# EAGLE design board (EAGLE 9.6.2)
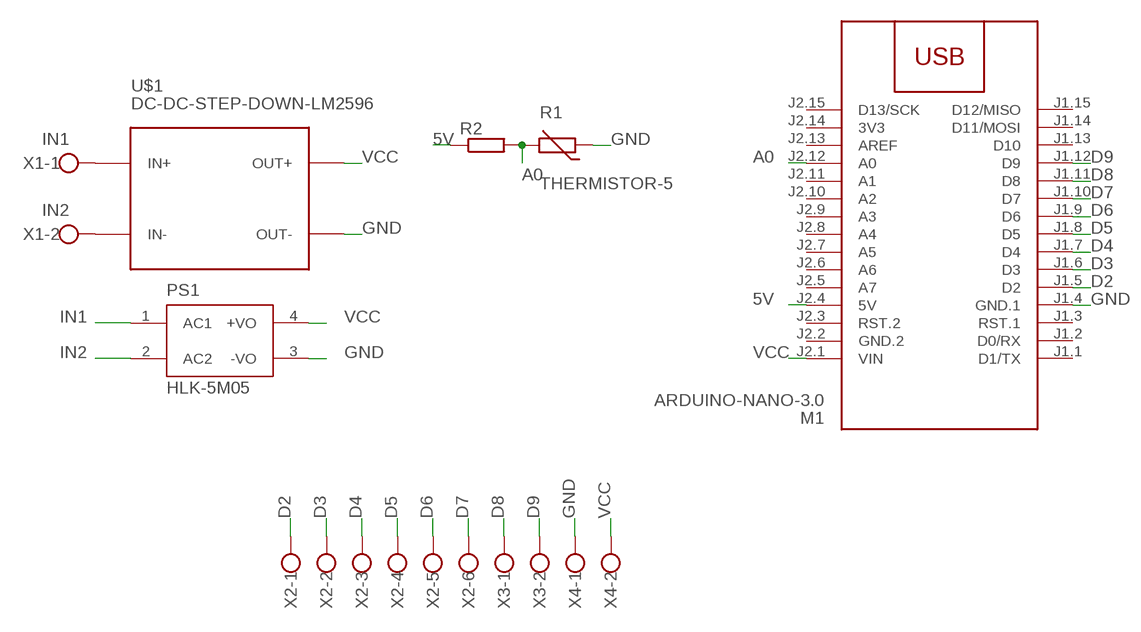
[diagram p0: schematic, sheet 1]

## Parts
M1  ARDUINO-NANO-3.0  [ARDUINO-NANO-3.0]
PS1  HLK-5M05  [CONV_HLK-5M05]
R1  THERMISTOR-5  [R-5]
R2  R-EU_0207/10  [0207/10]
U$1  DC-DC-STEP-DOWN-LM2596  [DC-DC-STEP-DOWN-LM2596]
X1  W237-102  [W237-102]
X2  W237-136  [W237-136]
X3  W237-102  [W237-102]
X4  W237-102  [W237-102]

## Nets
5V: M1.J2.4(5V) R2.1
A0: M1.J2.12(A0) R1.2 R2.2
D2: M1.J1.5(D2) X2.1
D3: M1.J1.6(D3) X2.2
D4: M1.J1.7(D4) X2.3
D5: M1.J1.8(D5) X2.4
D6: M1.J1.9(D6) X2.5
D7: M1.J1.10(D7) X2.6
D8: M1.J1.11(D8) X3.1
D9: M1.J1.12(D9) X3.2
GND: M1.J1.4(GND.1) PS1.3(-VO) R1.1 U$1.OUT- X4.1
IN1: PS1.1(AC1) U$1.IN+ X1.1
IN2: PS1.2(AC2) U$1.IN- X1.2
VCC: M1.J2.1(VIN) PS1.4(+VO) U$1.OUT+ X4.2
Unconnected: M1.J1.1(D1/TX) M1.J1.2(D0/RX) M1.J1.3(RST.1) M1.J1.13(D10) M1.J1.14(D11/MOSI) M1.J1.15(D12/MISO) M1.J2.3(RST.2) M1.J2.5(A7) M1.J2.6(A6) M1.J2.7(A5) M1.J2.8(A4) M1.J2.9(A3) M1.J2.10(A2) M1.J2.11(A1) M1.J2.13(AREF) M1.J2.15(D13/SCK)

## Power pins joined to a net without a drawn wire
3V3: M1.J2.14(3V3)
GND.2: M1.J2.2(GND.2)

## Library data of the parts
M1 = diy-modules:ARDUINO-NANO-3.0: Arduino Nano 3.0 and compatible devices More details available here: https://www.arduino.cc/en/Main/ArduinoBoardNano Click here to find device on ebay.com <http://www.ebay.com/sch/arduino+nano>
PS1 = HLK-5M05:HLK-5M05: AC DC 220V to 5V 5W 5Watt Isolated Switching Step-Down Power Supply Module Converter; AVAILABILITY: Unavailable; MF: Hi-link; MP: HLK-5M05; PACKAGE: Package Analog Devices; PRICE: None
R1 = varistor:THERMISTOR: THERMISTOR
R2 = rcl:R-EU_: RESISTOR, European symbol; SPICEPREFIX: R
U$1 = diy-modules:DC-DC-STEP-DOWN-LM2596: DC/DC Step-Down Regulator based on LM2596-ADJ chip LM2596 datasheet available here: http://www.ti.com/lit/ds/symlink/lm2596.pdf Click here to find device on ebay.com <http://www.ebay.com/sch/lm2596+power+regulator>
X1 X3 X4 = con-wago-500:W237-102: WAGO SCREW CLAMP; MPN: 237-102; OC_FARNELL: unknown; OC_NEWARK: 70K9898
X2 = con-wago-500:W237-136: WAGO SCREW CLAMP; MPN: 237-136; OC_FARNELL: unknown; OC_NEWARK: 84K9151

## Board
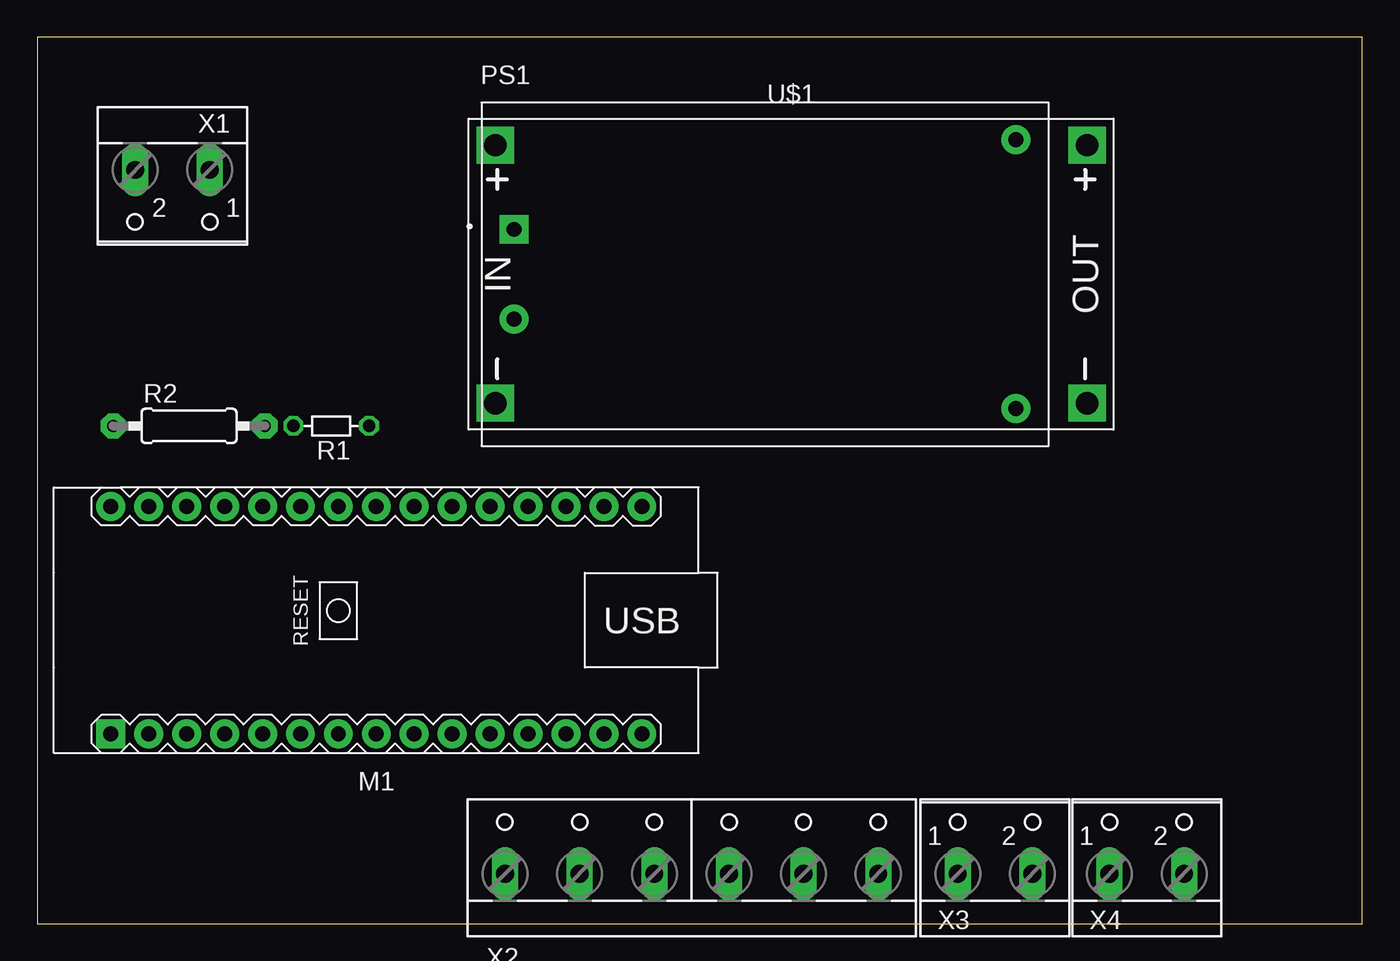
[diagram p1: board, top side]
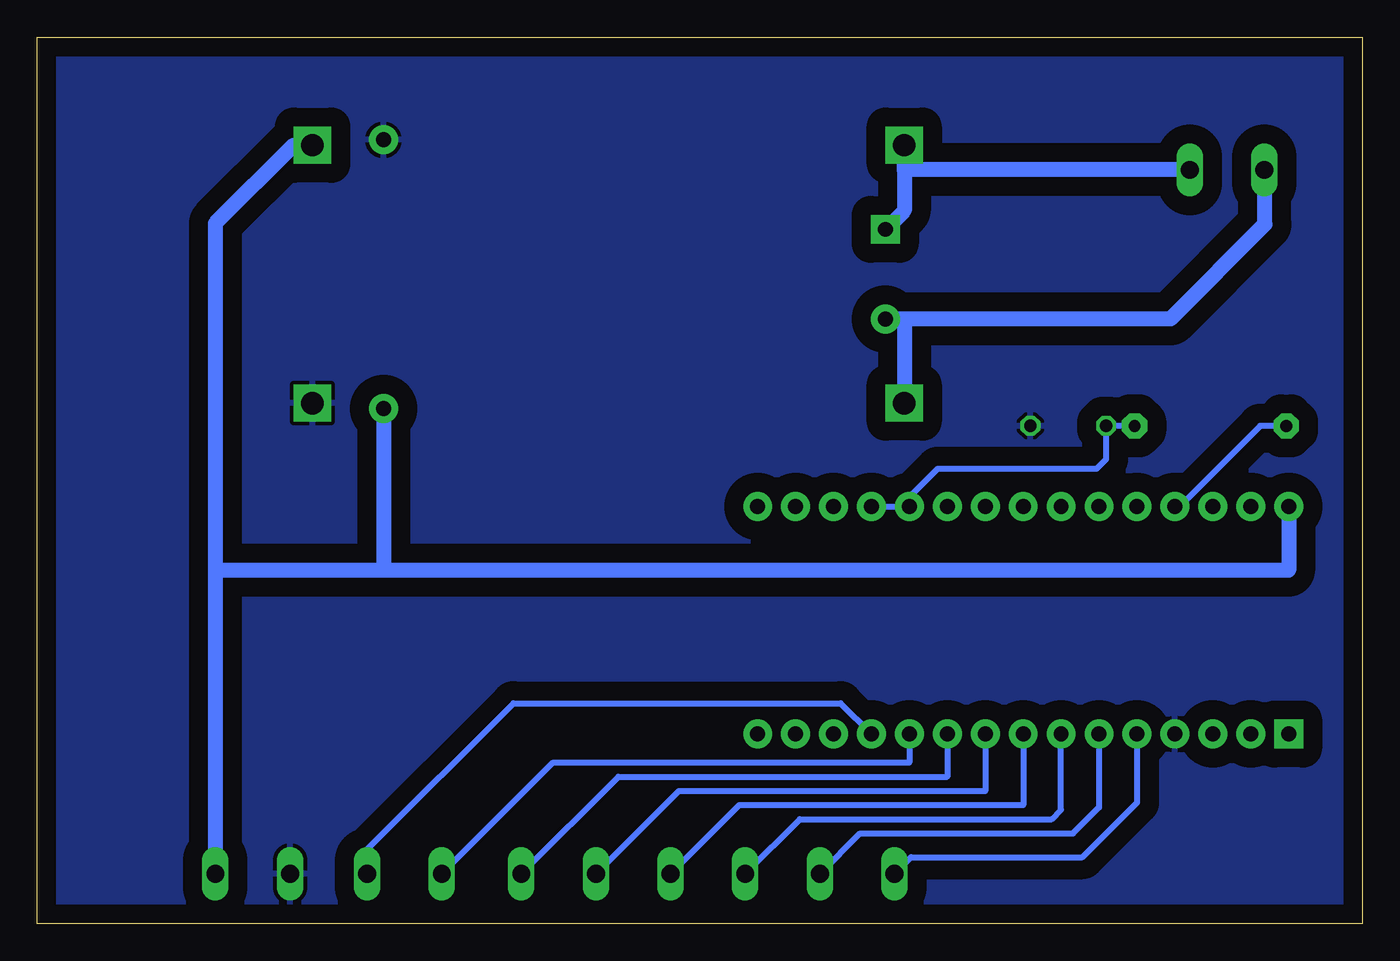
[diagram p2: board, bottom side, seen from below]

Size 88.72 x 59.36 mm. Coordinates in mm from the lower left corner, seen from the top.
Outline: 0,0 88.72,0 88.72,59.36 0,59.36 0,0
Copper layers (1*16): Top 0.035mm / dielectric 1.5mm / Bottom 0.035mm
Design rules "default": minimum track width 6mil, minimum drill 0.35mm, track to track 6mil, track to pad 6mil, pad to pad 6mil, via to via 6mil, smd to smd 6mil, copper to edge 40mil, drill to drill 6mil, minimum pad ring 10mil, minimum via ring 8mil, stop-mask expansion 4mil, vias tented up to drill 0mil, thermal gap 10mil

### Footprints (pad centres in the part's own frame; a part is rotated, then mirrored left to right if it is on the bottom)
ARDUINO-NANO-3.0 = drill 1 pad 1.93 square: J1.1 17.78,7.62 | drill 1 pad 1.93: J1.2 15.24,7.62; J1.3 12.7,7.62; J1.4 10.16,7.62; J1.5 7.62,7.62; J1.6 5.08,7.62; J1.7 2.54,7.62; J1.8 0,7.62; J1.9 -2.54,7.62; J1.10 -5.08,7.62; J1.11 -7.62,7.62; J1.12 -10.16,7.62; J1.13 -12.7,7.62; J1.14 -15.24,7.62; J1.15 -17.78,7.62; J2.1 17.78,-7.62; J2.2 15.24,-7.62; J2.3 12.7,-7.62; J2.4 10.16,-7.62; J2.5 7.62,-7.62; J2.6 5.08,-7.62; J2.7 2.54,-7.62; J2.8 0,-7.62; J2.9 -2.54,-7.62; J2.10 -5.08,-7.62; J2.11 -7.62,-7.62; J2.12 -10.16,-7.62; J2.13 -12.7,-7.62; J2.14 -15.24,-7.62; J2.15 -17.78,-7.62
CONV_HLK-5M05 = drill 1 pad 1.93 square: 1 -16.8,3 | drill 1 pad 1.93: 2 -16.8,-3; 3 16.8,9; 4 16.8,-9
R-5 = drill 0.813 octagon: 1 -2.54,0; 2 2.54,0
0207/10 = drill 0.8 pad 1.676 octagon: 1 -5.08,0; 2 5.08,0
DC-DC-STEP-DOWN-LM2596 = drill 1.5 pad 2.5 square: IN+ -19.812,8.636; IN- -19.812,-8.636; OUT+ 19.812,8.636; OUT- 19.812,-8.636
W237-102 = drill 1.194 long: 1 -2.5,-1.27; 2 2.5,-1.27
W237-136 = drill 1.194 long: 1 -12.5,-1.27; 2 -7.5,-1.27; 3 -2.5,-1.27; 4 2.5,-1.27; 5 7.5,-1.27; 6 12.5,-1.27

### Placement (x,y rotation side)
M1  22.7,20.32 180 top
PS1  48.74,43.5 0 top
R1  19.68,33.34 180 top
R2  10.16,33.34 0 top
U$1  50.48,43.5 0 top
X1  9.05,49.21 180 top
X2  43.81,4.6 0 top
X3  64.14,4.6 0 top
X4  74.3,4.6 0 top

### Tracks (layer width: path | path; a pad name or v marks a point on that pad's centre or on a via)
5V
  Bottom 0.406: R2.1 6.83,33.34 12.22,27.94 M1.J2.4
A0
  Bottom 0.406: R2.2 R1.2 17.14,31.11 17.78,30.48 28.42,30.48 30.96,27.94 M1.J2.12
D2
  Bottom 0.406: M1.J1.5 15.08,8.1 18.73,4.45 30.2,4.45 X2.1
D3
  Bottom 0.406: X2.2 33.62,6.03 19.37,6.03 17.62,7.78 M1.J1.6
D4
  Bottom 0.406: M1.J1.7 20.16,7.62 20.8,6.99 37.66,6.99 X2.3
D5
  Bottom 0.406: X2.4 41.71,7.94 22.7,7.94 M1.J1.8
D6
  Bottom 0.406: M1.J1.9 25.24,8.89 45.76,8.89 X2.5
D7
  Bottom 0.406: M1.J1.10 27.78,9.84 49.81,9.84 X2.6
D8
  Bottom 0.406: X3.1 54.17,10.79 30.32,10.79 M1.J1.11
D9
  Bottom 0.406: M1.J1.12 34.92,14.76 56.83,14.76 66.64,4.96 X3.2
GND
  pour Bottom (isolate 1.27): 0,60.17 89.06,60.17 89.06,-0.48 0,-0.48
IN1
  Bottom 1.016: 30.67,50.8 30.67,50.48 X1.1 | 30.67,50.8 U$1.IN+ | 30.67,50.8 30.67,47.77 PS1.1
IN2
  Bottom 0.406: 6.51,50.52 X1.2
  Bottom 1.016: X1.2 6.55,46.87 6.51,46.83 12.84,40.5 PS1.2 30.82,40.5 30.67,40.34 U$1.IN-
VCC
  Bottom 1.016: M1.J2.1 4.92,23.65 65.54,23.65 | U$1.OUT+ 71.56,52.13 76.8,46.9 76.8,23.65 | 76.8,23.65 X4.2 | 65.54,23.65 76.8,23.65 | PS1.4 65.54,23.65